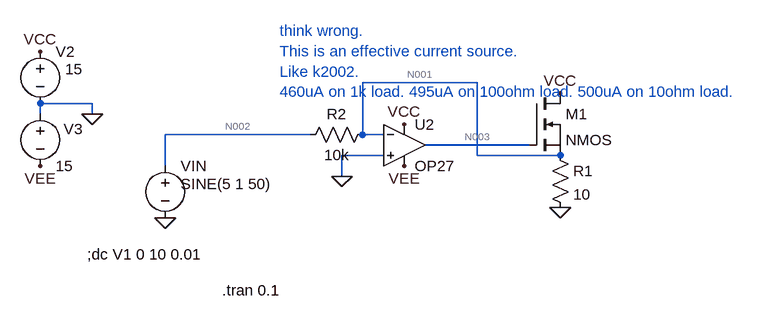
[diagram p0: schematic Draft25.asc]
Draft25.asc, the LTspice schematic file:
Version 4
SHEET 1 980 680
WIRE 528 0 352 0
WIRE -64 32 -144 32
WIRE -144 48 -144 32
WIRE -64 48 -64 32
WIRE 272 80 48 80
WIRE 352 80 352 0
WIRE 384 80 352 80
WIRE 608 96 448 96
WIRE 384 112 320 112
WIRE 528 112 528 0
WIRE 656 112 528 112
WIRE 48 128 48 80
WIRE 320 144 320 112
FLAG 48 208 0
FLAG -64 48 0
FLAG -144 -48 VCC
FLAG 416 64 VCC
FLAG -144 128 VEE
FLAG 416 128 VEE
FLAG 656 192 0
FLAG 656 16 VCC
FLAG 320 144 0
SYMBOL voltage 48 112 R0
WINDOW 123 0 0 Left 0
WINDOW 39 0 0 Left 0
WINDOW 3 24 44 Left 2
SYMATTR Value SINE(5 1 50)
SYMATTR InstName VIN
SYMBOL voltage -144 -64 R0
WINDOW 123 0 0 Left 0
WINDOW 39 0 0 Left 0
WINDOW 3 38 43 Left 2
SYMATTR Value 15
SYMATTR InstName V2
SYMBOL voltage -144 32 R0
WINDOW 123 0 0 Left 0
WINDOW 39 0 0 Left 0
WINDOW 0 36 39 Left 2
SYMATTR InstName V3
SYMATTR Value 15
SYMBOL OpAmps\\OP27 416 32 R0
SYMATTR InstName U2
SYMBOL nmos 608 16 R0
SYMATTR InstName M1
SYMBOL res 640 96 R0
SYMATTR InstName R1
SYMATTR Value 10
SYMBOL res 368 64 R90
WINDOW 0 0 56 VBottom 2
WINDOW 3 32 56 VTop 2
SYMATTR InstName R2
SYMATTR Value 10k
TEXT -72 264 Left 2 !;dc V1 0 10 0.01
TEXT 136 320 Left 2 !.tran 0.1
TEXT 224 -80 Left 2 ;think wrong.\nThis is an effective current source.\nLike k2002.\n460uA on 1k load. 495uA on 100ohm load. 500uA on 10ohm load.

The netlist it stands for:
* Draft25.asc
VIN N002 0 SINE(5 1 50)
V2 VCC 0 15
V3 0 VEE 15
XU2 0 N001 VCC VEE N003 OP27  ; pins In+ In- V+ V- OUT
M1 VCC N003 N001 N001 NMOS
R1 N001 0 10
R2 N001 N002 10k
.model NMOS NMOS
.model PMOS PMOS
.lib standard.mos
;dc V1 0 10 0.01
.tran 0.1
* think wrong.
* This is an effective current source.
* Like k2002.
* 460uA on 1k load. 495uA on 100ohm load. 500uA on 10ohm load.
.lib ADI.lib
.backanno
.end

* Results of the author's LTspice run, read from the files saved beside the schematic
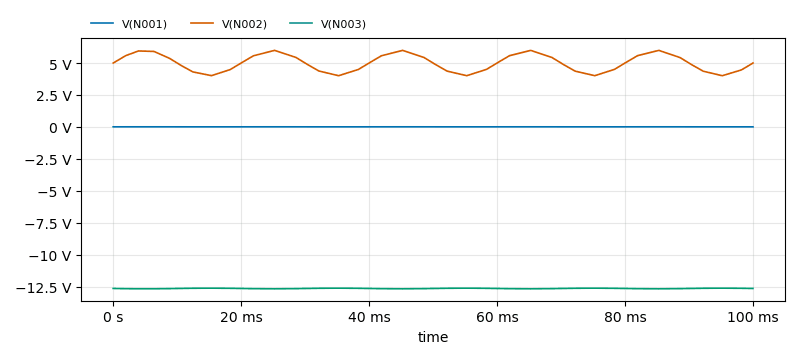
[diagram p1: Transient Analysis of Draft25.asc, plotted from the saved traces]
* Transient Analysis, 1 run:
*   V(N001): min 4.003 mV, max 5.985 mV, average 4.992 mV, rms 5.038 mV, last 4.995 mV
*   V(N002): min 4.006 V, max 5.991 V, average 4.997 V, rms 5.043 V, last 5 V
*   V(N003): min -12.68 V, max -12.62 V, average -12.65 V, rms 12.65 V, last -12.65 V